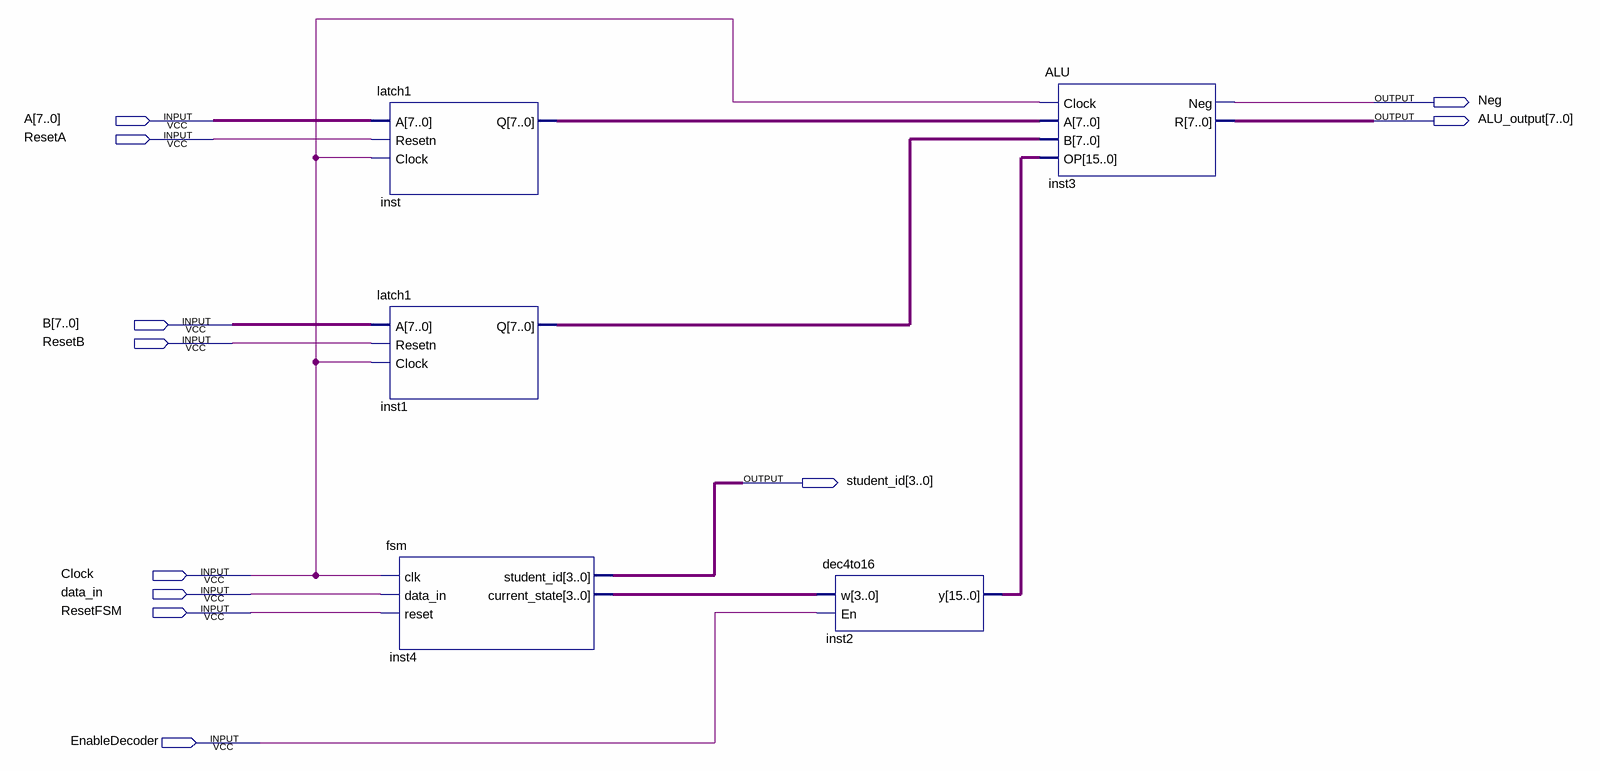
[diagram p0: schematic sheet]
// Quartus schematic finalDesign.bdf as structural Verilog: 5 symbols, 11 pins
module finalDesign (
  input  [7:0] A,
  input  ResetA,
  input  [7:0] B,
  input  ResetB,
  input  Clock,
  input  data_in,
  input  ResetFSM,
  input  EnableDecoder,
  output Neg,
  output [7:0] ALU_output,
  output [3:0] student_id
);

  wire [3:0] inst4_current_state;
  wire [7:0] inst1_q, inst_q;
  wire [15:0] inst2_y;

  latch1 inst (.A(A), .Resetn(ResetA), .Clock(Clock), .Q(inst_q));
  latch1 inst1 (.A(B), .Resetn(ResetB), .Clock(Clock), .Q(inst1_q));
  fsm inst4 (
    .clk(Clock), .data_in(data_in), .reset(ResetFSM), .student_id(student_id),
    .current_state(inst4_current_state));
  dec4to16 inst2 (.w(inst4_current_state), .En(EnableDecoder), .y(inst2_y));
  ALU inst3 (.Clock(Clock), .A(inst_q), .B(inst1_q), .OP(inst2_y), .Neg(Neg), .R(ALU_output));
endmodule
